# Altium project Motor Driver.PrjPcb
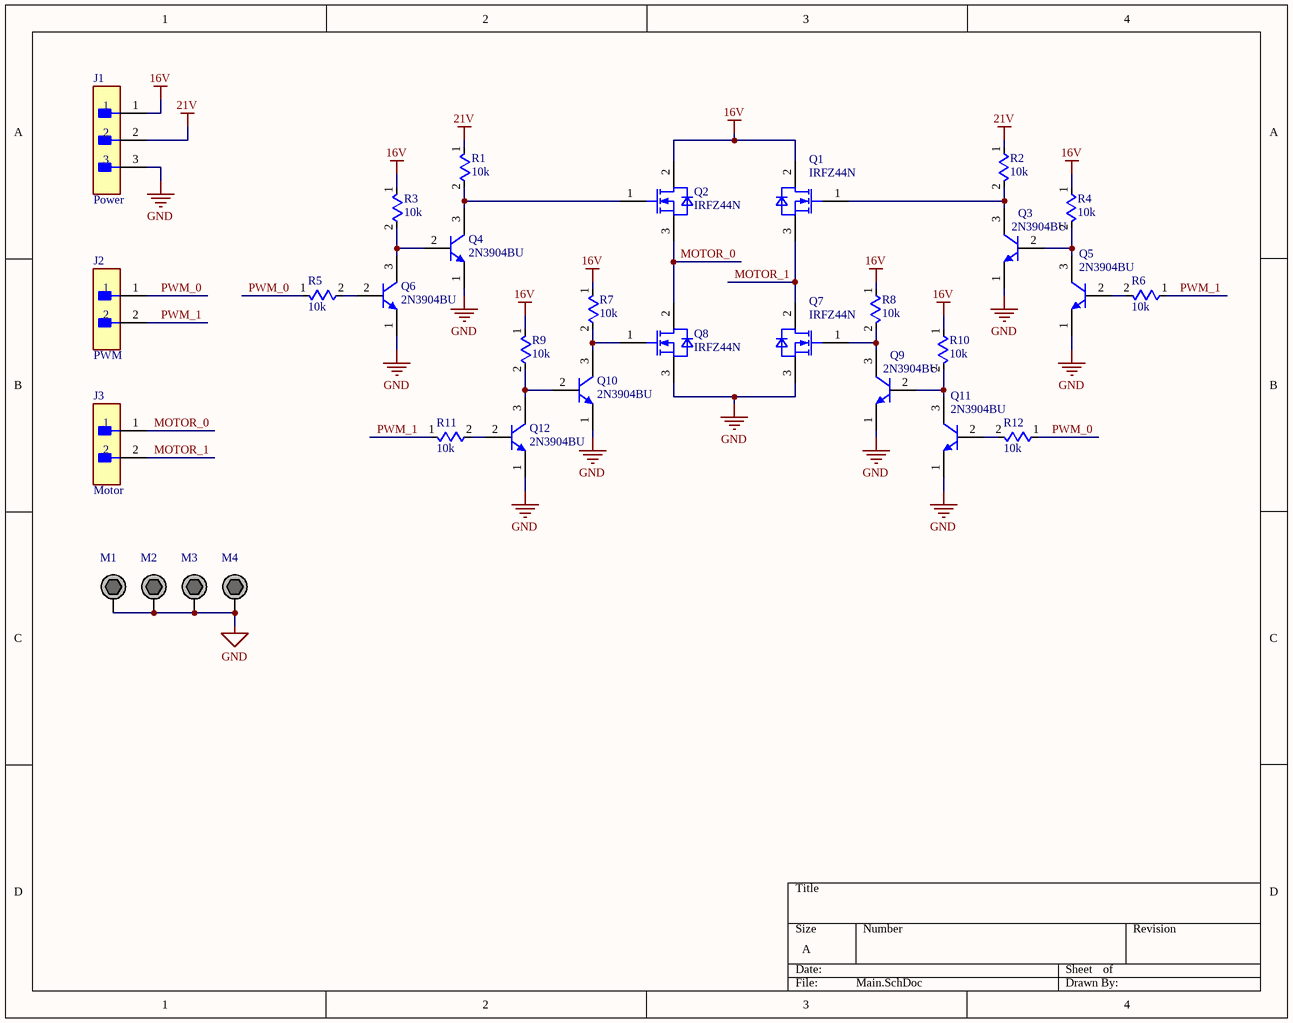
[diagram p0: Main.SchDoc]
1 sheet, 31 parts. Net scope: global (net labels, ports and power ports of the same name join across sheets).
Board file: Motor Driver.PcbDoc

## Sheet Main.SchDoc
size A; SheetNumber: 1; SheetTotal: 1

### Parts
J1  Power  [FP-B3B-XH-A_LF_SN-MFG]
J2  PWM  [FP-B2B-XH-A_LF_SN-MFG]
J3  Motor  [FP-B2B-XH-A_LF_SN-MFG]
M1  M3 Mounting Hole Plated  [M3 Screw Hole - Plated]  (value not drawn)  (no BOM)
M2  M3 Mounting Hole Plated  [M3 Screw Hole - Plated]  (value not drawn)  (no BOM)
M3  M3 Mounting Hole Plated  [M3 Screw Hole - Plated]  (value not drawn)  (no BOM)
M4  M3 Mounting Hole Plated  [M3 Screw Hole - Plated]  (value not drawn)  (no BOM)
Q1  IRFZ44N  [IFX-PG-TO220-3-904-1]
Q2  IRFZ44N  [IFX-PG-TO220-3-904-1]
Q3  2N3904BU  [2n3904]
Q4  2N3904BU  [2n3904]
Q5  2N3904BU  [2n3904]
Q6  2N3904BU  [2n3904]
Q7  IRFZ44N  [IFX-PG-TO220-3-904-1]
Q8  IRFZ44N  [IFX-PG-TO220-3-904-1]
Q9  2N3904BU  [2n3904]
Q10  2N3904BU  [2n3904]
Q11  2N3904BU  [2n3904]
Q12  2N3904BU  [2n3904]
R1  10k  [Axial 0.5]
R2  10k  [Axial 0.5]
R3  10k  [Axial 0.5]
R4  10k  [Axial 0.5]
R5  10k  [Axial 0.5]
R6  10k  [Axial 0.5]
R7  10k  [Axial 0.5]
R8  10k  [Axial 0.5]
R9  10k  [Axial 0.5]
R10  10k  [Axial 0.5]
R11  10k  [Axial 0.5]
R12  10k  [Axial 0.5]

### Nets
16V: J1.1 Q1.2(DRAIN) Q2.2(DRAIN) R3.1 R4.1 R7.1 R8.1 R9.1 R10.1
21V: J1.2 R1.1 R2.1
GND: J1.3 M1.1 M2.1 M3.1 M4.1 Q3.1(E) Q4.1(E) Q5.1(E) Q6.1(E) Q7.3(SOURCE) Q8.3(SOURCE) Q9.1(E) Q10.1(E) Q11.1(E) Q12.1(E)
MOTOR_0: J3.1 Q2.3(SOURCE) Q8.2(DRAIN)
MOTOR_1: J3.2 Q1.3(SOURCE) Q7.2(DRAIN)
PWM_0: J2.1 R5.1 R12.1
PWM_1: J2.2 R6.1 R11.1
NetQ1_1: Q1.1(GATE) Q3.3(C) R2.2
NetQ2_1: Q2.1(GATE) Q4.3(C) R1.2
NetQ3_2: Q3.2(B) Q5.3(C) R4.2
NetQ4_2: Q4.2(B) Q6.3(C) R3.2
NetQ5_2: Q5.2(B) R6.2
NetQ6_2: Q6.2(B) R5.2
NetQ7_1: Q7.1(GATE) Q9.3(C) R8.2
NetQ8_1: Q8.1(GATE) Q10.3(C) R7.2
NetQ9_2: Q9.2(B) Q11.3(C) R10.2
NetQ10_2: Q10.2(B) Q12.3(C) R9.2
NetQ11_2: Q11.2(B) R12.2
NetQ12_2: Q12.2(B) R11.2

### Library data of the parts
J1 = CMP-17439-000014-3: CONN HEADER VERT 3POS 2.5MM; Max Voltage Rating (DC): 250V; Number of Positions: 3; Current Rating: 3A; Gender: Male; Wire/Cable Gauge: 22AWG; Contact Resistance: 20mR; Insulation Resistance: 1GR; Insulation Material: Nylon; Contact Plating: Tin; Depth: 5.75mm; Contact Type: Male Pin; Max Operating Temperature: 85°C; Insulation Color: Natural; Voltage Rating (AC): 250V; Color: Natural; Connector Type: Header; Orientation: Straight; Fastening Type: Detent; Housing Color: White; Min Operating Temperature: -25°C; Termination: Solder; Voltage Rating: 250V; Series: XH; Pitch: 2.5mm; Contact Shape: Square; Number of Rows: 1; Lead Free: Lead Free; Packaging: Bulk; Mount: Through Hole; Flammability Rating: UL94 V-0; Max Voltage Rating (AC): 250V; REACH SVHC: No SVHC; Housing Material: Polyamide; Contact Material: Brass; Lead Pitch: 2.5mm; Contact Finish - Mating: TIN; Length: 9.9mm; Max Current Rating: 3A; Number of Contacts: 3
J2 J3 = CMP-2000-05888-3: CONN HEADER VERT 2POS 2.5MM; Current Rating: 3A; Voltage Rating: 250V; Number of Contacts: 2; Contact Resistance: 20mR; Wire/Cable Gauge: 22AWG; Insulation Resistance: 1GR; Connector Type: Male Pin; Packaging: Bulk; Contact Material: Brass; Lead Free: Lead Free; Orientation: Straight; Contact Plating: Tin; Max Current Rating: 3A; Termination: Solder; Fastening Type: Detent; Depth: 5.75mm; Housing Material: Polyamide; REACH SVHC: No SVHC; Series: XH; Voltage Rating (AC): 250V; Number of Positions: 2; Color: Natural; Contact Type: Male Pin; Max Voltage Rating (DC): 250V; Pitch: 2.5mm; Lead Pitch: 2.5mm; Mount: Through Hole; Max Operating Temperature: 85°C; Length: 7.4mm; Max Voltage Rating (AC): 250V; Min Operating Temperature: -25°C; Number of Rows: 1; Housing Color: White
M1-M4 = CMP-019-000000-3: Design Item ID: M3 Mounting Hole Plated; Source: UBC Formula Electric.SchLib
Q1 Q2 Q7 Q8 = IRFZ44N: OptiMOS 3 Power-Transistor, VDS 100V; Manufacturer: Infineon Technologies; Manufacturer Order Number: IRFZ44N; PackageReference: PG-TO220-3-904
Q3-Q6 Q9-Q12 = 2n3904: NPN General-Purpose Amplifier, 40 V VCEO, 0.2 A, -55 to 150 degC, 2-Pin TO-92, RoHS, Bulk; Manufacturer: FairchildSemiconductor; Maximum Collector Base Voltage: 60V; Minimum DC Current Gain: 40@0.1mA@1V; Maximum Collector Emitter Voltage: 40V; Maximum DC Collector Current: 0.2A; Rad Hard: No; Maximum Operating Frequency: 300(Min)MHz; Maximum Collector Emitter Saturation Voltage: 0.2@1mA@10mA; Maximum Power Dissipation: 625mW; Package Description: 3-Pin Transistor Outline Package, Body Dia 4.79 mm, Pitch 1.27 mm; Package Reference: TO-92; Pin Count: 3; Operating Temperature: -55to150degC; Category: GPBJT; Manufacturer URL: https://www.fairchildsemi.com/; Datasheet URL: https://datasheet.ciiva.com/4722/2n3904-82270-4722369.pdf; Package: 3TO-92; Packaging: Bulk; Type: NPN; Datasheet Version: Rev. 1.1.0, 10/2014; Mounting: ThroughHole
R1-R12 = RES_GENERIC